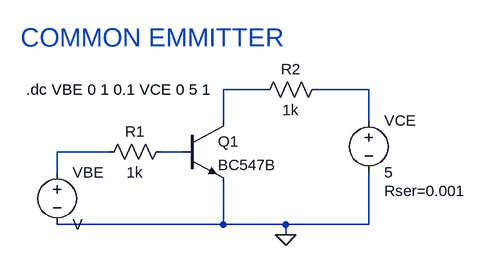
[diagram p0: schematic Common_Emmitter.asc]
Common_Emmitter.asc, the LTspice schematic file:
Version 4
SHEET 1 880 680
WIRE 240 64 176 64
WIRE 400 64 320 64
WIRE 176 112 176 64
WIRE 400 112 400 64
WIRE 0 160 -80 160
WIRE 112 160 80 160
WIRE -80 192 -80 160
WIRE 176 272 176 208
WIRE 176 272 -80 272
WIRE 272 272 176 272
WIRE 400 272 400 192
WIRE 400 272 272 272
WIRE 272 288 272 272
FLAG 272 288 0
SYMBOL npn 112 112 R0
SYMATTR InstName Q1
SYMATTR Value BC547B
SYMBOL voltage 400 96 R0
WINDOW 123 0 0 Left 0
WINDOW 39 24 124 Left 2
SYMATTR InstName VCE
SYMATTR Value 5
SYMATTR SpiceLine Rser=0.001
SYMBOL voltage -80 176 R0
SYMATTR InstName VBE
SYMBOL res 96 144 R90
WINDOW 0 0 56 VBottom 2
WINDOW 3 32 56 VTop 2
SYMATTR InstName R1
SYMATTR Value 1k
SYMBOL res 336 48 R90
WINDOW 0 0 56 VBottom 2
WINDOW 3 32 56 VTop 2
SYMATTR InstName R2
SYMATTR Value 1k
TEXT -128 64 Left 2 !.dc VBE 0 1 0.1 VCE 0 5 1
TEXT -136 -16 Left 4 ;COMMON EMMITTER

The netlist it stands for:
* Common_Emmitter.asc
Q1 N001 N004 0 0 BC547B
VCE N002 0 5 Rser=0.001
VBE N003 0 V
R1 N004 N003 1k
R2 N002 N001 1k
.model NPN NPN
.model PNP PNP
.lib standard.bjt
.dc VBE 0 1 0.1 VCE 0 5 1
* COMMON EMMITTER
.backanno
.end